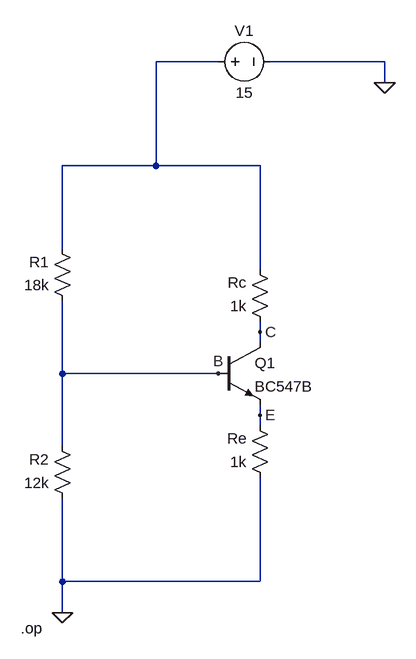
[diagram p0: schematic Voltage Divider Bias Circuit BJT.asc]
Voltage Divider Bias Circuit BJT.asc, the LTspice schematic file:
Version 4
SHEET 1 880 680
WIRE 576 -336 480 -336
WIRE 832 -336 656 -336
WIRE 832 -304 832 -336
WIRE 480 -176 480 -336
WIRE 480 -176 336 -176
WIRE 640 -176 480 -176
WIRE 336 -48 336 -176
WIRE 640 -16 640 -176
WIRE 640 80 640 64
WIRE 640 96 640 80
WIRE 336 144 336 32
WIRE 576 144 336 144
WIRE 640 208 640 192
WIRE 640 224 640 208
WIRE 336 256 336 144
WIRE 336 464 336 336
WIRE 640 464 640 304
WIRE 640 464 336 464
WIRE 336 512 336 464
FLAG 336 512 0
FLAG 832 -304 0
FLAG 576 144 B
FLAG 640 80 C
FLAG 640 208 E
SYMBOL npn 576 96 R0
SYMATTR InstName Q1
SYMATTR Value BC547B
SYMBOL res 352 48 R180
WINDOW 0 36 76 Left 2
WINDOW 3 36 40 Left 2
SYMATTR InstName R1
SYMATTR Value 18k
SYMBOL res 352 352 R180
WINDOW 0 36 76 Left 2
WINDOW 3 36 40 Left 2
SYMATTR InstName R2
SYMATTR Value 12k
SYMBOL res 656 80 R180
WINDOW 0 36 76 Left 2
WINDOW 3 36 40 Left 2
SYMATTR InstName Rc
SYMATTR Value 1k
SYMBOL res 656 320 R180
WINDOW 0 36 76 Left 2
WINDOW 3 36 40 Left 2
SYMATTR InstName Re
SYMATTR Value 1k
SYMBOL voltage 560 -336 R270
WINDOW 0 32 56 VTop 2
WINDOW 3 -32 56 VBottom 2
WINDOW 123 0 0 Left 0
WINDOW 39 0 0 Left 0
SYMATTR InstName V1
SYMATTR Value 15
TEXT 272 536 Left 2 !.op

The netlist it stands for:
* Voltage Divider Bias Circuit BJT.asc
Q1 C B E 0 BC547B
R1 B N001 18k
R2 0 B 12k
Rc C N001 1k
Re 0 E 1k
V1 N001 0 15
.model NPN NPN
.model PNP PNP
.lib standard.bjt
.op
.backanno
.end